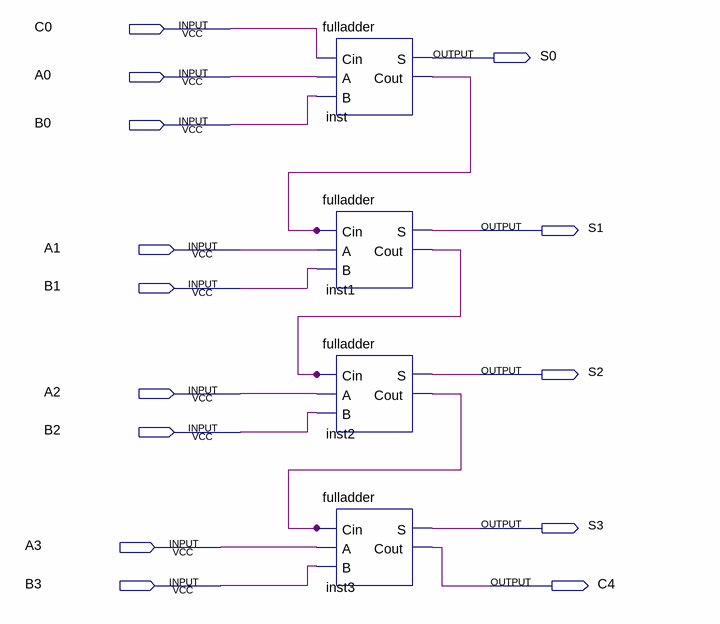
[diagram p0: schematic sheet]
// Quartus schematic adder4bits.bdf as structural Verilog: 4 symbols, 14 pins
module adder4bits (
  input  C0,
  input  A0,
  input  B0,
  input  A1,
  input  B1,
  input  A2,
  input  B2,
  input  A3,
  input  B3,
  output S0,
  output S1,
  output S2,
  output S3,
  output C4
);

  wire inst1_cout, inst2_cout, inst_cout;

  fulladder inst (.Cin(C0), .A(A0), .B(B0), .S(S0), .Cout(inst_cout));
  fulladder inst1 (.Cin(inst_cout), .A(A1), .B(B1), .S(S1), .Cout(inst1_cout));
  fulladder inst2 (.Cin(inst1_cout), .A(A2), .B(B2), .S(S2), .Cout(inst2_cout));
  fulladder inst3 (.Cin(inst2_cout), .A(A3), .B(B3), .S(S3), .Cout(C4));
endmodule
